# Altium schematic sheet Subtrator OPAMP.SchDoc
size A4
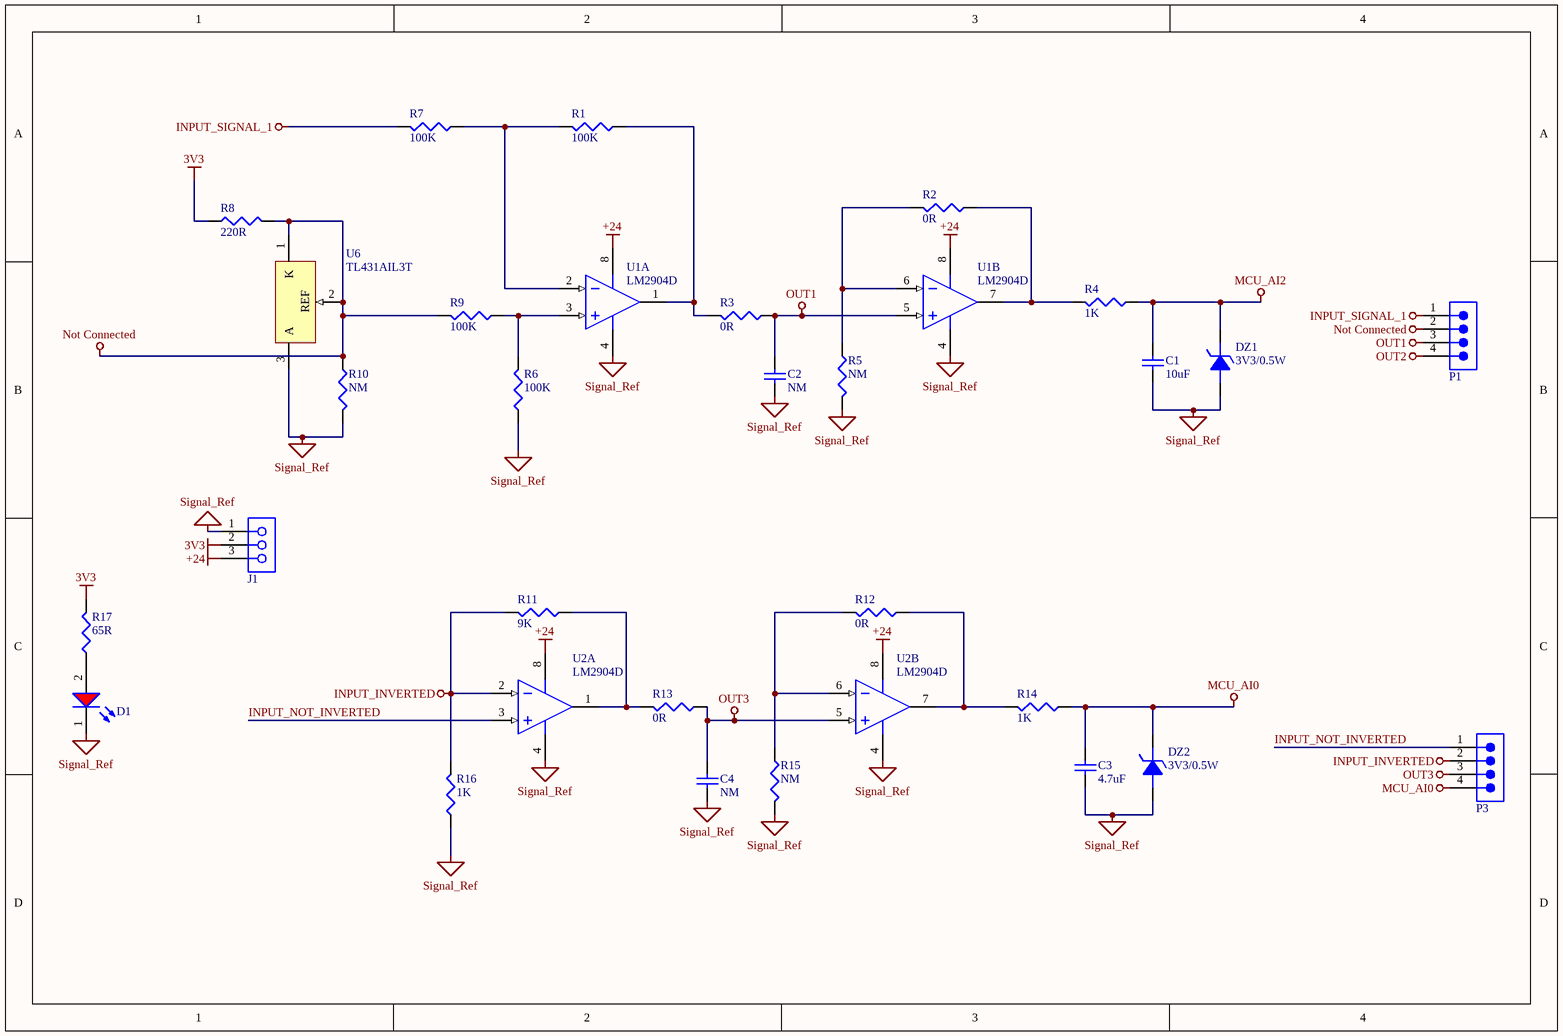
[diagram p0: Subtrator OPAMP.SchDoc]

## Parts
C1  10uF  [WCAP-CSGP_0805_H=0.6mm_Reflow]
C2  NM  [WCAP-CSGP_0805_H=0.6mm_Reflow]
C3  4.7uF  [WCAP-CSGP_0805_H=0.6mm_Reflow]
C4  NM  [WCAP-CSGP_0805_H=0.6mm_Reflow]
D1  Red, 2V, 140°  [WL-SMCD_0603]  (value not drawn)
DZ1  3V3/0.5W  [SOD80]
DZ2  3V3/0.5W  [SOD80]
J1  613003143121  [613003143121]  (value not drawn)
P1  61300411121  [61300411121]  (value not drawn)
P3  61300411121  [61300411121]  (value not drawn)
R1  100K  [SM/R_1206]
R2  0R  [SM/R_1206]
R3  0R  [SM/R_1206]
R4  1K  [SM/R_1206]
R5  NM  [SM/R_1206]
R6  100K  [SM/R_1206]
R7  100K  [SM/R_1206]
R8  220R  [SM/R_1206]
R9  100K  [SM/R_1206]
R10  NM  [SM/R_1206]
R11  9K  [SM/R_1206]
R12  0R  [SM/R_1206]
R13  0R  [SM/R_1206]
R14  1K  [SM/R_1206]
R15  NM  [SM/R_1206]
R16  1K  [SM/R_1206]
R17  65R  [SM/R_0805]
U1  LM2904D  [SO8_N]  (parts A,B of 2)
U2  LM2904D  [SO8_N]  (parts A,B of 2)
U6  TL431AIL3T  [SOT23-3_N]

## Nets
3V3: J1.2 R8.1 R17.2
+24: J1.3 U1.8(V+) U2.8(V+)
INPUT_INVERTED: P3.2 R11.2 R16.2 U2.2(IN-)
INPUT_SIGNAL_1: P1.1 R7.2
MCU_AI0: C3.2 DZ2.K(CATHODE) P3.4 R14.1
MCU_AI2: C1.2 DZ1.K(CATHODE) R4.1
Not Connected: P1.2 R8.2 R9.2 R10.1 U6.1(K) U6.2(REF)
OUT1: C2.2 P1.3 R3.1 U1.5(IN+)
OUT2: P1.4
OUT3: C4.2 P3.3 R13.1 U2.5(IN+)
Signal_Ref: C1.1 C2.1 C3.1 C4.1 D1.1(K) DZ1.A(ANODE) DZ2.A(ANODE) J1.1 R5.2 R6.1 R10.2 R15.2 R16.1 U1.4(V-) U2.4(V-) U6.3(A)
INPUT_NOT_INVERTED: P3.1 U2.3(IN+)
NetD1_2: D1.2(A) R17.1
NetR1_1: R1.1 R3.2 U1.1(OUT)
NetR1_2: R1.2 R7.1 U1.2(IN-)
NetR2_1: R2.1 R4.2 U1.7(OUT)
NetR2_2: R2.2 R5.1 U1.6(IN-)
NetR6_2: R6.2 R9.1 U1.3(IN+)
NetR11_1: R11.1 R13.2 U2.1(OUT)
NetR12_1: R12.1 R14.2 U2.7(OUT)
NetR12_2: R12.2 R15.1 U2.6(IN-)

## Library data of the parts
C1-C4 = 885012007010: WCAP-CSGP Multilayer Ceramic Chip Capacitor, General Purpose, size 0805, NP0, 10pF, 16V; Manufacturer: Wurth Elektronik; Rated Voltage: 16VDC; Isolation Resistance: >=10GOhm; Capacitance Tolerance: +/-5%; Dissipation Factor: Q>=400+20C; Technical Reference: NP00805100J016DFCT10000; ComponentLink1Description: Manufacturer; ComponentLink1URL: http://www.we-online.de; ComponentLink2Description: Datasheet; ComponentLink2URL: https://www.we-online.com/catalog/datasheet/885012007010.pdf; Operating Temperature: -55 to +125degC; Packaging: Tape and Reel; Manufacturer Part Number: 885012007010; Published Date: May 2020; Ceramic Type: NP0; Height: 0.6mm; Mounting Technology: SMT; Size: 0805; Capacitance: 10pF
D1 = 150060RS55040: WL-SMCD Mono-color Chip LED Diffused, SMT, size 0603, Red, 2V, 140°; Manufacturer: Wurth Elektronik; Case/Size Code: 0603; Chip Technology: AlInGaP; Dominant Wavelength: 624nm; Luminous Intensity: 90mcd; Peak Wavelength: 632nm; Manufacturer Part Number: 150060RS55040; Category: Signal LEDs; Match Code: WL-SMCD; ComponentLink1Description: Website Link; ComponentLink1URL: https://www.we-online.com/redexpert/article/150060RS55040?ad; ComponentLink2Description: Datasheet Link; ComponentLink2URL: https://www.we-online.com/redexpert/spec/150060RS55040?ad; Mount: Surface Mount; Operating Temperature Max: 85°C; Operating Temperature Min: -40°C; Packaging: Tape and Reel; Length: 1.6mm; Width: 0.8mm; Height: 0.4mm; Emitting Color: Red; Forward Voltage: 2V; Viewing Angle: 140°
DZ1 DZ2 = SOD80_zener: DIODE ZENER 22V 500MW SOD80C; Manufacturer: Nexperia; Manufacturer Part Number: BZV55-C22,115; Supplier 1: Newark; Supplier Part Number 1: 96K7268; RoHS: Yes; Category: Zener Diodes; Stock 1: 10881; Pricing 1: 5=0.22000, 10=0.20800, 25=0.14200, 50=0.11200, 100=0.09200, 250=0.07200, 500=0.05500, 1000=0.04800 (USD); RoHS Compliant: Yes; ComponentLink1URL: https://assets.nexperia.com/documents/data-sheet/BZV55_SER.pdf?src-supplier=Digi-Key; ComponentLink1Description: https://assets.nexperia.com/documents/data-sheet/BZV55_SER.pdf?src-supplier=Digi-Key
J1 = 613003143121: WR-PHD Socket Header, THT, Angled, pitch 2.54mm, 1 Row, 3P; Manufacturer: Wurth Elektronik; Contact Resistance: 20mΩ; Rated Current: 3A; Working Voltage: 250V; Withstanding Voltage: 500V; ComponentLink1Description: Website Link; ComponentLink1URL: https://www.we-online.com/redexpert/article/613003143121?ad; ComponentLink2Description: Datasheet Link; ComponentLink2URL: https://www.we-online.com/redexpert/spec/613003143121?ad; Manufacturer Part Number: 613003143121; Category: Board-to-Board Connectors; Match Code: WR-PHD; Mount: Through Hole; Operating Temperature Max: 125°C; Operating Temperature Min: -40°C; Packaging: Tray; Gender: Socket Header; Number of Pins: 3; Number of Rows: 1; Orientation: Angled; Pitch: 2.54mm
P1 P3 = 61300411121: WR-PHD Pin Header, THT, Vertical, pitch 2.54mm, 1 Row, 4P; Manufacturer: Wurth Elektronik; Contact Resistance: 20mΩ; Rated Current: 3A; Working Voltage: 250V; Withstanding Voltage: 500V; ComponentLink1Description: Website Link; ComponentLink1URL: https://www.we-online.com/redexpert/article/61300411121?ad; ComponentLink2Description: Datasheet Link; ComponentLink2URL: https://www.we-online.com/redexpert/spec/61300411121?ad; Manufacturer Part Number: 61300411121; Category: Board-to-Board Connectors; Match Code: WR-PHD; Mount: Through Hole; Operating Temperature Max: 105°C; Operating Temperature Min: -40°C; Packaging: Bag; Gender: Pin Header; Number of Pins: 4; Number of Rows: 1; Orientation: Vertical; Pitch: 2.54mm
R1-R17 = SMRes: SMD Resistor; Mounting: SMD; RoHS: Yes; Category: Chip SMD Resistors; Stock 1: 1; Pricing 1: 10=0.67400, 100=0.52000, 250=0.49300, 500=0.33100, 1000=0.28900 (USD); Mount: Surface Mount; Number of Pins: 2; Resistor Type: FIXED RESISTOR
U1 U2 = LM2903D: Low-Power Dual Voltage Comparator; Published: 24-Aug-2001; LatestRevisionDate: 13-Apr-2006; LatestRevisionNote: IPC-7351 Footprint Added.; DatasheetVersion: Oct-1999; PackageVersion: Dec-2002; PackageReference: SO8; Publisher: Altium Limited; PackageDescription: 8-Pin Small Outline Integrated Circuit 1.27 mm Pitch; Code_JEDEC: MS-012-AA; Code_IPC: SOIC127P600-8; ComponentLink1Description: Manufacturer Link; ComponentLink1URL: http://www.st.com/; ComponentLink2Description: Datasheet; ComponentLink2URL: http://www.st.com/stonline/products/literature/ds/2470/lm2903.pdf
U6 = TL431AIL3T: STMICROELECTRONICS - TL431AIL3T - Voltage Reference, AEC-Q100, Shunt - Adjustable, 2.5V to 36V, 1 % Ref, SOT-23-3; Max Input Voltage: 37V; Max Output Current: 100mA; Reference Type: Shunt,Adjustable; Tolerance: 1%; Number of Channels: 1; Cathode Current: 700uA; Reference Voltage: 2.495V; DatasheetVersion: Oct-2011; PackageVersion: 2011; PackageReference: SOT23-3; PackageDescription: 3-Pin SOT-23 Package 0.95 mm Pitch, 2.4 mm Lead Span; ComponentLink1Description: Manufacturer URL; ComponentLink1URL: http://www.st.com; ComponentLink2Description: Datasheet; ComponentLink2URL: http://www.st.com/internet/com/TECHNICAL_RESOURCES/TECHNICAL_LITERATURE/DATASHEET/CD00000986.pdf; Supplier 1: Digi-Key; Supplier Part Number 1: 497-11295-1-ND; Manufacturer: STMicroelectronics; Manufacturer Part Number: TL431AIL3T; RoHS: Yes; Category: Voltage References; Stock 1: 3767; Pricing 1: 1=0.47000, 10=0.38000, 25=0.34720, 100=0.25850, 250=0.23424, 500=0.19386, 1000=0.14539 (USD); Mount: Surface Mount; Case/Package: SOT-23-3; Number of Pins: 3; Min Operating Temperature: -40°C; Max Operating Temperature: 105°C; Output Voltage: 36V; Package Quantity: 1; Packaging: Tape and Reel; Output Current: 100mA; Max Output Voltage: 36V; Accuracy: 1%; Series: -; Radiation Hardening: No; Lead Free: Lead Free; RoHS Compliant: Yes; ComponentLink3URL: https://datasheet.ciiva.com/41424/001184461-da-01-en-ic-vref-shunt-pr-tl431ail3t-sot-23-3-stm-41424435.pdf?src-supplier=Conrad; ComponentLink3Description: https://datasheet.ciiva.com/41424/001184461-da-01-en-ic-vref-shunt-pr-tl431ail3t-sot-23-3-stm-41424435.pdf?src-supplier=Conrad; ComponentLink4URL: https://datasheet.ciiva.com/2006/cd00000986-2006624.pdf?src-supplier=Digi-Key; ComponentLink4Description: https://datasheet.ciiva.com/2006/cd00000986-2006624.pdf?src-supplier=Digi-Key; ComponentLink5URL: https://datasheet.ciiva.com/2006/cd00000986-2006625.pdf?src-supplier=Digi-Key; ComponentLink5Description: https://datasheet.ciiva.com/2006/cd00000986-2006625.pdf?src-supplier=Digi-Key; ComponentLink6URL: https://datasheet.ciiva.com/2006/cd00000986-2006626.pdf?src-supplier=Digi-Key; ComponentLink6Description: https://datasheet.ciiva.com/2006/cd00000986-2006626.pdf?src-supplier=Digi-Key; ComponentLink7URL: https://datasheet.ciiva.com/4908/cd00000986-4908895.pdf?src-supplier=Mouser; ComponentLink7Description: https://datasheet.ciiva.com/4908/cd00000986-4908895.pdf?src-supplier=Mouser; ComponentLink8URL: https://datasheet.ciiva.com/17565/cd00000986-17565254.pdf?src-supplier=Avnet+Europe; ComponentLink8Description: https://datasheet.ciiva.com/17565/cd00000986-17565254.pdf?src-supplier=Avnet+Europe